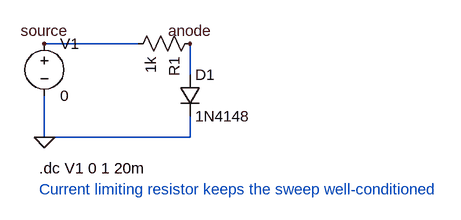
[diagram p0: schematic 04_dc_diode_curve.asc]
04_dc_diode_curve.asc, the LTspice schematic file:
Version 4
SHEET 1 880 680
WIRE 80 96 224 96
WIRE 304 96 304 144
WIRE 304 208 304 240
WIRE 80 176 80 240
WIRE 80 240 304 240
FLAG 80 240 0
FLAG 80 96 source
FLAG 304 96 anode
SYMBOL voltage 80 80 R0
SYMATTR InstName V1
SYMATTR Value 0
SYMBOL res 320 80 R90
SYMATTR InstName R1
SYMATTR Value 1k
SYMBOL diode 288 144 R0
SYMATTR InstName D1
SYMATTR Value 1N4148
TEXT 72 288 Left 2 !.dc V1 0 1 20m
TEXT 72 320 Left 2 ;Current limiting resistor keeps the sweep well-conditioned

The netlist it stands for:
* 04_dc_diode_curve.asc
V1 source 0 0
R1 anode source 1k
D1 anode 0 1N4148
.model D D
.lib standard.dio
.dc V1 0 1 20m
* Current limiting resistor keeps the sweep well-conditioned
.backanno
.end